# EAGLE design PowerTestbenchBoard (EAGLE 9.4.2)
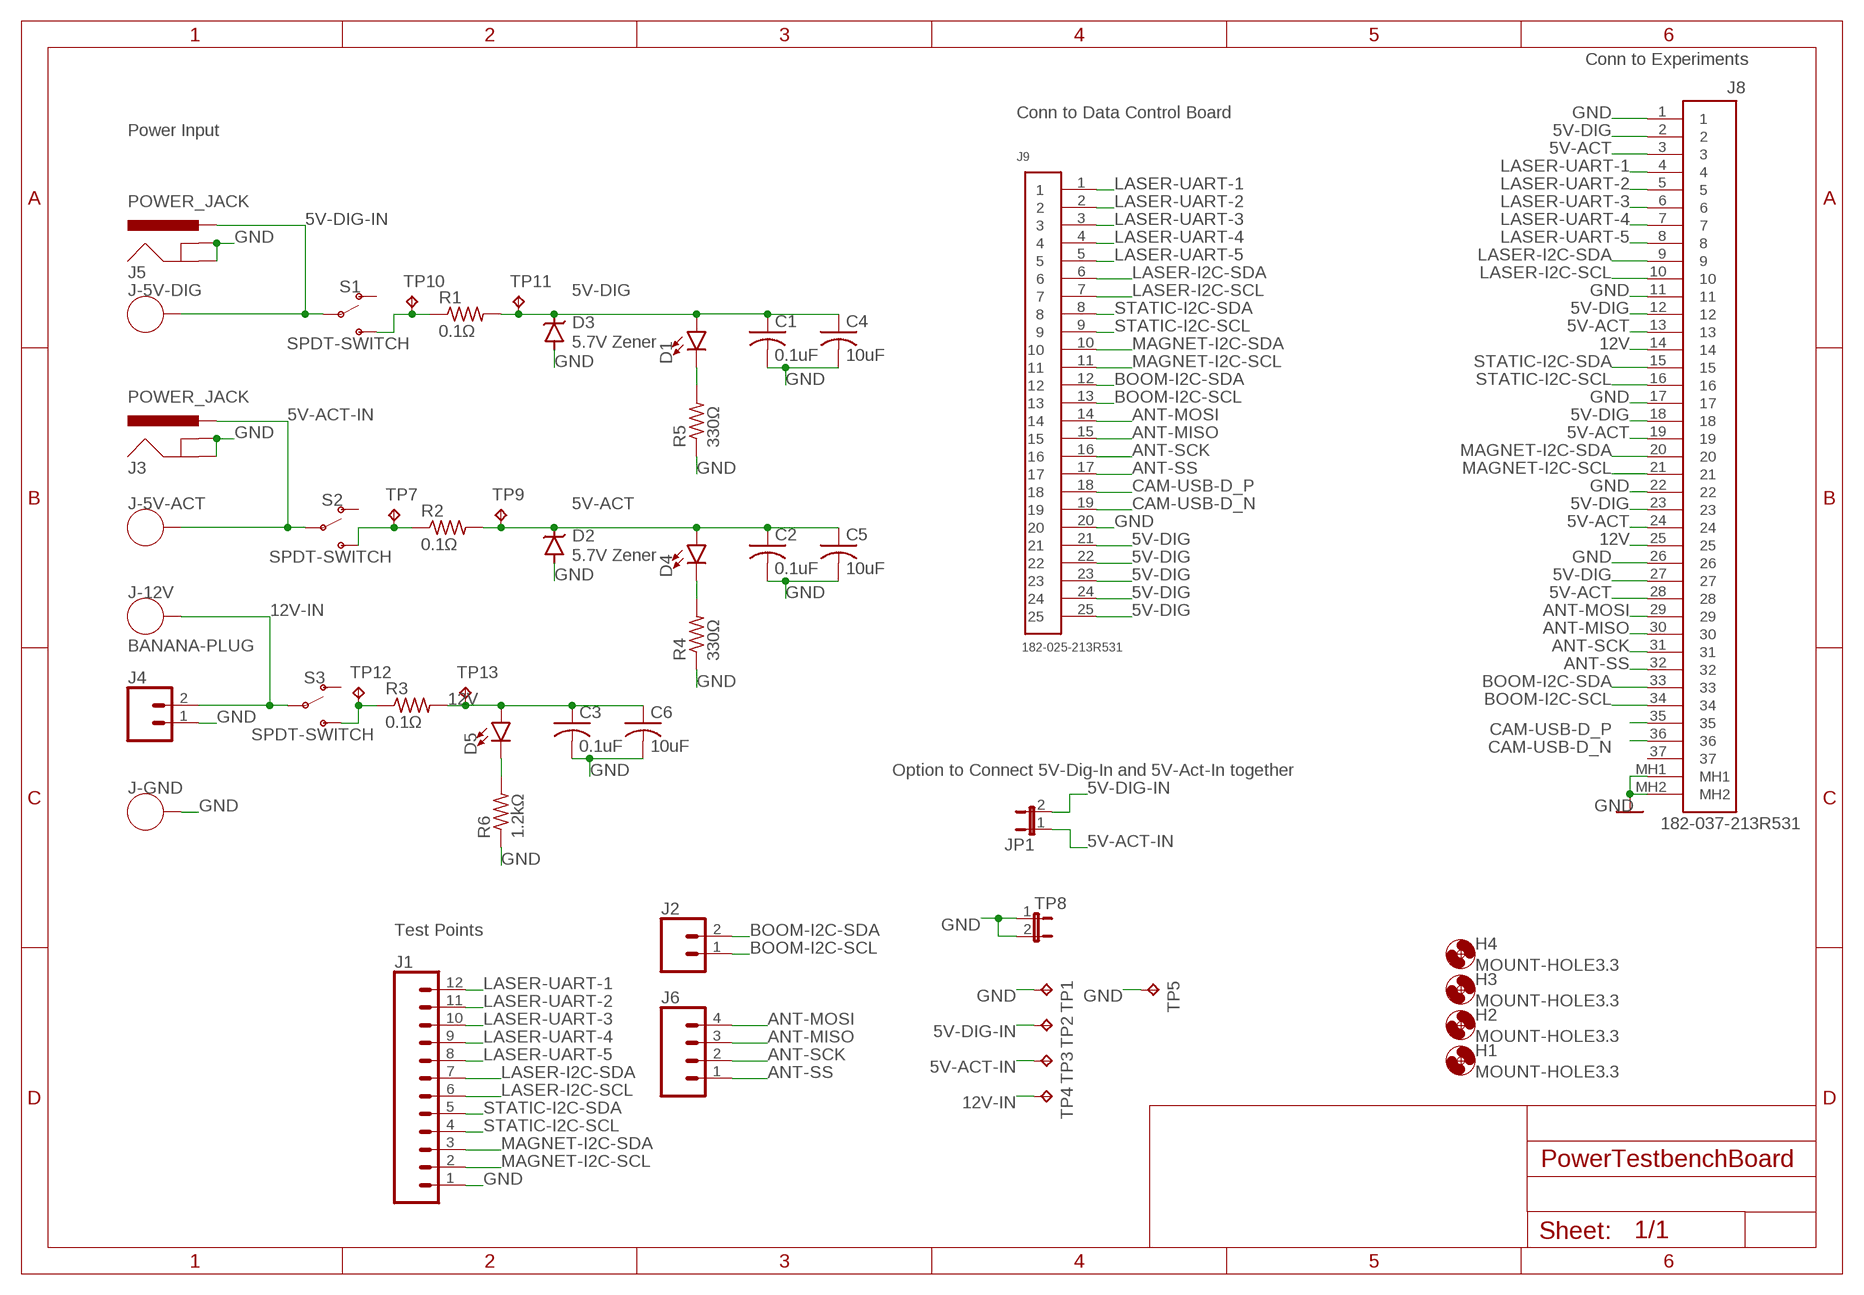
[diagram p0: schematic, sheet 1]

## Parts
C1  0.1uF  C-USC0805  [C0805]
C2  0.1uF  C-USC0805  [C0805]
C3  0.1uF  C-USC0805  [C0805]
C4  10uF  C-USC0805  [C0805]
C5  10uF  C-USC0805  [C0805]
C6  10uF  C-USC0805  [C0805]
D1  LED-3MM-NO_SILK  [LED_3MM-NS]
D2  5.7V Zener  ZENER-GENERICSMB  [SMB]
D3  5.7V Zener  ZENER-GENERICSMB  [SMB]
D4  LED-3MM-NO_SILK  [LED_3MM-NS]
D5  LED-3MM-NO_SILK  [LED_3MM-NS]
H1  MOUNT-HOLE3.3  [3,3]
H2  MOUNT-HOLE3.3  [3,3]
H3  MOUNT-HOLE3.3  [3,3]
H4  MOUNT-HOLE3.3  [3,3]
J1  CONN_12  [1X12]
J2  CONN_02  [1X02]
J3  POWER_JACK  [POWER_JACK_PTH]
J4  CONN_023.5MM  [SCREWTERMINAL-3.5MM-2]
J5  POWER_JACK  [POWER_JACK_PTH]
J6  CONN_04  [1X04]
J8  182-037-213R531  [182-037-213R531]
J9  182-025-213R531  [182-025-213R531]
J-5V-ACT  BANANA-PLUG  [BANANA-JACK]
J-5V-DIG  BANANA-PLUG  [BANANA-JACK]
J-12V  BANANA-PLUG  [BANANA-JACK]
J-GND  BANANA-PLUG  [BANANA-JACK]
JP1  JP1E  [JP1]
R1  0.1Ω  R-US_R1206  [R1206]
R2  0.1Ω  R-US_R1206  [R1206]
R3  0.1Ω  R-US_R1206  [R1206]
R4  330Ω  R-US_R0805  [R0805]
R5  330Ω  R-US_R0805  [R0805]
R6  1.2kΩ  R-US_R0805  [R0805]
S1  SPDT-SWITCH  [SWITCH_SPDT_PTH_11.6X4.0MM]
S2  SPDT-SWITCH  [SWITCH_SPDT_PTH_11.6X4.0MM]
S3  SPDT-SWITCH  [SWITCH_SPDT_PTH_11.6X4.0MM]
TP1  TPPAD1-13  [P1-13]
TP2  TPPAD1-13  [P1-13]
TP3  TPPAD1-13  [P1-13]
TP4  TPPAD1-13  [P1-13]
TP5  TPPAD1-13  [P1-13]
TP7  TPPAD1-13  [P1-13]
TP8  JP1E  [JP1]
TP9  TPPAD1-13  [P1-13]
TP10  TPPAD1-13  [P1-13]
TP11  TPPAD1-13  [P1-13]
TP12  TPPAD1-13  [P1-13]
TP13  TPPAD1-13  [P1-13]

## Nets
5V-ACT: C2.1 C5.1 D2.C D4.A J8.3 J8.13 J8.19 J8.24 J8.28 R2.2 TP9.TP
5V-ACT-IN: J3.PWR J-5V-ACT.P$1 J-5V-ACT.P$2 JP1.1 S2.2(P) TP3.TP
5V-DIG: C1.1 C4.1 D1.A D3.C J8.2 J8.12 J8.18 J8.23 J8.27 J9.21 J9.22 J9.23 J9.24 J9.25 R1.2 TP11.TP
5V-DIG-IN: J5.PWR J-5V-DIG.P$1 J-5V-DIG.P$2 JP1.2 S1.2(P) TP2.TP
12V: C3.1 C6.1 D5.A J8.14 J8.25 R3.2 TP13.TP
12V-IN: J4.2 J-12V.P$1 J-12V.P$2 S3.2(P) TP4.TP
ANT-MISO: J6.3 J8.30 J9.15
ANT-MOSI: J6.4 J8.29 J9.14
ANT-SCK: J6.2 J8.31 J9.16
ANT-SS: J6.1 J8.32 J9.17
BOOM-I2C-SCL: J2.1 J8.34 J9.13
BOOM-I2C-SDA: J2.2 J8.33 J9.12
CAM-USB-D_N [diff-pair]: J8.36 J9.19
CAM-USB-D_P [diff-pair]: J8.35 J9.18
GND: C1.2 C2.2 C3.2 C4.2 C5.2 C6.2 D2.A D3.A J1.1 J3.GND J3.GNDBREAK J4.1 J5.GND J5.GNDBREAK J8.1 J8.11 J8.17 J8.22 J8.26 J8.MH1 J8.MH2 J9.20 J-GND.P$1 J-GND.P$2 R4.1 R5.1 R6.1 TP1.TP TP5.TP TP8.1 TP8.2
LASER-I2C-SCL: J1.6 J8.10 J9.7
LASER-I2C-SDA: J1.7 J8.9 J9.6
LASER-UART-1: J1.12 J8.4 J9.1
LASER-UART-2: J1.11 J8.5 J9.2
LASER-UART-3: J1.10 J8.6 J9.3
LASER-UART-4: J1.9 J8.7 J9.4
LASER-UART-5: J1.8 J8.8 J9.5
MAGNET-I2C-SCL: J1.2 J8.21 J9.11
MAGNET-I2C-SDA: J1.3 J8.20 J9.10
N$1: R1.1 S1.1(S) TP10.TP
N$2: R2.1 S2.1(S) TP7.TP
N$3: R3.1 S3.1(S) TP12.TP
N$4: D4.K(C) R4.2
N$5: D5.K(C) R6.2
N$6: D1.K(C) R5.2
STATIC-I2C-SCL: J1.4 J8.16 J9.9
STATIC-I2C-SDA: J1.5 J8.15 J9.8
Unconnected: J8.37 S1.3(O) S2.3(O) S3.3(O)

## Notes on the sheet
- Conn to Experiments
- Conn to Data Control Board
- Power Input
- Option to Connect 5V-Dig-In and 5V-Act-In together
- Test Points

## Library data of the parts
C1-C6 = rcl:C-US: CAPACITOR, American symbol; SPICEPREFIX: C
D1 D4 D5 = SparkFun-LED:LED: LED (Generic) Standard schematic elements and footprints for 5mm, 3mm, 1206, and 0603 sized LEDs. Generic LEDs with no color specified.
D2 D3 = PowerManagementParts:ZENER-GENERIC
H1-H4 = holes:MOUNT-HOLE: MOUNTING HOLE with drill center marker
J1 = SparkFun-Connectors:CONN_12: Multi connection point. Often used as Generic Header-pin footprint for 0.1 inch spaced/style header connections On any of the 0.1 inch spaced packages, you can populate with these: Break Away Headers - Straight <https://www.sparkfun.com/products/116> (PRT-00116) Break Away Male Headers - Right Angle <https://www.sparkfun.com/products/553> (PRT-00553) Female Headers <https://www.sparkfun.com/products/115> (PRT-00115) Break Away Headers - Machine Pin <https://www.sparkfun.com/products/117> (PRT-00117) Break Away Female Headers - Swiss Machine Pin <https://www.sparkfun.com/products/743> (PRT-00743) For SCREWTERMINALS and SPRING TERMINALS visit here: Screw Terimnals on SparkFun.com <https://www.sparkfun.com/search/results?term=Screw+Terminals> (5mm/3.5mm/2.54mm spacing) This device is also useful as a general connection point to wire up your design to another part of your project. Our various solder wires solder well into these plated through hole pads. Hook-Up Wire - Assortment (Stranded, 22 AWG) <https://www.sparkfun.com/products/11375> (PRT-11375) Hook-Up Wire - Assortment (Solid Core, 22 AWG) <https://www.sparkfun.com/products/11367> (PRT-11367) View the entire wire category on our website here <https://www.sparkfun.com/categories/141> Special notes: Molex polarized connector foot print use with SKU : PRT-08231 with associated crimp pins and housings. 1MM SMD Version SKU: PRT-10208 NOTES ON THE VARIANTS LOCK and LOCK_LONGPADS... This footprint was designed to help hold the alignment of a through-hole component (i.e. 6-pin header) while soldering it into place. You may notice that each hole has been shifted either up or down by 0.005 of an inch from it's more standard position (which is a perfectly straight line). This slight alteration caused the pins (the squares in the middle) to touch the edges of the holes. Because they are alternating, it causes a "brace" to hold the component in place. 0.005 has proven to be the perfect amount of "off-center" position when using our standard breakaway headers. Although looks a little odd when you look at the bare footprint, once you have a header in there, the alteration is very hard to notice. Also,if you push a header all the way into place, it is covered up entirely on the bottom side.
J2 = SparkFun-Connectors:CONN_02: Multi connection point. Often used as Generic Header-pin footprint for 0.1 inch spaced/style header connections On any of the 0.1 inch spaced packages, you can populate with these: Break Away Headers - Straight <https://www.sparkfun.com/products/116> (PRT-00116) Break Away Male Headers - Right Angle <https://www.sparkfun.com/products/553> (PRT-00553) Female Headers <https://www.sparkfun.com/products/115> (PRT-00115) Break Away Headers - Machine Pin <https://www.sparkfun.com/products/117> (PRT-00117) Break Away Female Headers - Swiss Machine Pin <https://www.sparkfun.com/products/743> (PRT-00743) For SCREWTERMINALS and SPRING TERMINALS visit here: Screw Terimnals on SparkFun.com <https://www.sparkfun.com/search/results?term=Screw+Terminals> (5mm/3.5mm/2.54mm spacing) This device is also useful as a general connection point to wire up your design to another part of your project. Our various solder wires solder well into these plated through hole pads. Hook-Up Wire - Assortment (Stranded, 22 AWG) <https://www.sparkfun.com/products/11375> (PRT-11375) Hook-Up Wire - Assortment (Solid Core, 22 AWG) <https://www.sparkfun.com/products/11367> (PRT-11367) View the entire wire category on our website here <https://www.sparkfun.com/categories/141> Special notes: Molex polarized connector foot print use with: PRT-08233 with associated crimp pins and housings. 2.54_SCREWTERM for use with PRT-10571. 3.5mm Screw Terminal footprints for PRT-08084 5mm Screw Terminal footprints for use with PRT-08432
J3 J5 = SparkFun-Connectors:POWER_JACK: Power Jack Connector This is the standard 5.5mm barrel jack for power. The PTH is the most common, proven, reliable, footprint. The Slot footprint only works if the mill layer is transmitted to the PCB fab house so be warned. Here are the connectors we sell at SparkFun: DC Barrel Power Jack/Connector <https://www.sparkfun.com/products/119> (PRT-00119) DC Barrel Power Jack/Connector (SMD) <https://www.sparkfun.com/products/12748> (PRT-12748) DC Barrel Jack Adapter - Breadboard Compatible <https://www.sparkfun.com/products/10811> (PRT-10811) It is used on this SparkFun product (and many, many others): SparkFun RedBoard - Programmed with Arduino <https://www.sparkfun.com/products/12757> (DEV-12757) Also, if you need a mating power supply or connector, please check these out: Wall Adapter Power Supply - 9VDC 650mA <https://www.sparkfun.com/products/298> (TOL-00298) DC Barrel Jack Adapter - Male <https://www.sparkfun.com/products/10287> (PRT-10287); PROD_ID: CONN-08197
J4 = SparkFun-Connectors:CONN_02: Multi connection point. Often used as Generic Header-pin footprint for 0.1 inch spaced/style header connections On any of the 0.1 inch spaced packages, you can populate with these: Break Away Headers - Straight <https://www.sparkfun.com/products/116> (PRT-00116) Break Away Male Headers - Right Angle <https://www.sparkfun.com/products/553> (PRT-00553) Female Headers <https://www.sparkfun.com/products/115> (PRT-00115) Break Away Headers - Machine Pin <https://www.sparkfun.com/products/117> (PRT-00117) Break Away Female Headers - Swiss Machine Pin <https://www.sparkfun.com/products/743> (PRT-00743) For SCREWTERMINALS and SPRING TERMINALS visit here: Screw Terimnals on SparkFun.com <https://www.sparkfun.com/search/results?term=Screw+Terminals> (5mm/3.5mm/2.54mm spacing) This device is also useful as a general connection point to wire up your design to another part of your project. Our various solder wires solder well into these plated through hole pads. Hook-Up Wire - Assortment (Stranded, 22 AWG) <https://www.sparkfun.com/products/11375> (PRT-11375) Hook-Up Wire - Assortment (Solid Core, 22 AWG) <https://www.sparkfun.com/products/11367> (PRT-11367) View the entire wire category on our website here <https://www.sparkfun.com/categories/141> Special notes: Molex polarized connector foot print use with: PRT-08233 with associated crimp pins and housings. 2.54_SCREWTERM for use with PRT-10571. 3.5mm Screw Terminal footprints for PRT-08084 5mm Screw Terminal footprints for use with PRT-08432; PROD_ID: CONN-08399
J6 = SparkFun-Connectors:CONN_04: Multi connection point. Often used as Generic Header-pin footprint for 0.1 inch spaced/style header connections On any of the 0.1 inch spaced packages, you can populate with these: Break Away Headers - Straight <https://www.sparkfun.com/products/116> (PRT-00116) Break Away Male Headers - Right Angle <https://www.sparkfun.com/products/553> (PRT-00553) Female Headers <https://www.sparkfun.com/products/115> (PRT-00115) Break Away Headers - Machine Pin <https://www.sparkfun.com/products/117> (PRT-00117) Break Away Female Headers - Swiss Machine Pin <https://www.sparkfun.com/products/743> (PRT-00743) For SCREWTERMINALS and SPRING TERMINALS visit here: Screw Terimnals on SparkFun.com <https://www.sparkfun.com/search/results?term=Screw+Terminals> (5mm/3.5mm/2.54mm spacing) This device is also useful as a general connection point to wire up your design to another part of your project. Our various solder wires solder well into these plated through hole pads. Hook-Up Wire - Assortment (Stranded, 22 AWG) <https://www.sparkfun.com/products/11375> (PRT-11375) Hook-Up Wire - Assortment (Solid Core, 22 AWG) <https://www.sparkfun.com/products/11367> (PRT-11367) View the entire wire category on our website here <https://www.sparkfun.com/categories/141> Special notes: Molex polarized connector foot print use with SKU : PRT-08231 with associated crimp pins and housings. 1MM SMD Version SKU: PRT-10208; PROD_ID: CONN-09696
J8 = D-Sub Connectors:182-037-213R531: CONN D-SUB RCPT 37POS R/A SOLDER Manufacturer's datasheet <https://media.digikey.com/pdf/Data%20Sheets/Norcomp%20PDFs/182-YYY-213RYY1.pdf>; CREATED_BY: PCBLayout.com; DIGI_KEY_PART_NUMBER: 182-37FE-ND; MANUFACTURER: NorComp Inc.; MPN: 182-037-213R531
J9 = D-Sub Connectors:182-025-213R531: CONN D-SUB RCPT 25POS R/A SOLDER Manufacturer's datasheet <https://media.digikey.com/pdf/Data%20Sheets/Norcomp%20PDFs/182-YYY-213RYY1.pdf>; CREATED_BY: PCBLayout.com; DIGIKEY_PART_NO: 182-25FE-ND; MANUFACTURER: NorComp Inc.; MPN: 182-025-213R531
J-5V-ACT J-5V-DIG J-12V J-GND = PowerManagementParts:BANANA-PLUG
JP1 TP8 = jumper:JP1E: JUMPER
R1-R6 = rcl:R-US_: RESISTOR, American symbol; SPICEPREFIX: R
S1-S3 = PowerManagementParts:SPDT-SWITCH
TP1-TP5 TP7 TP9-TP13 = testpad:TP: Test pad

## Net classes
1 diff-pair: width 0.203 mm, drill 0.348 mm, clearance 0.203 mm

## Board
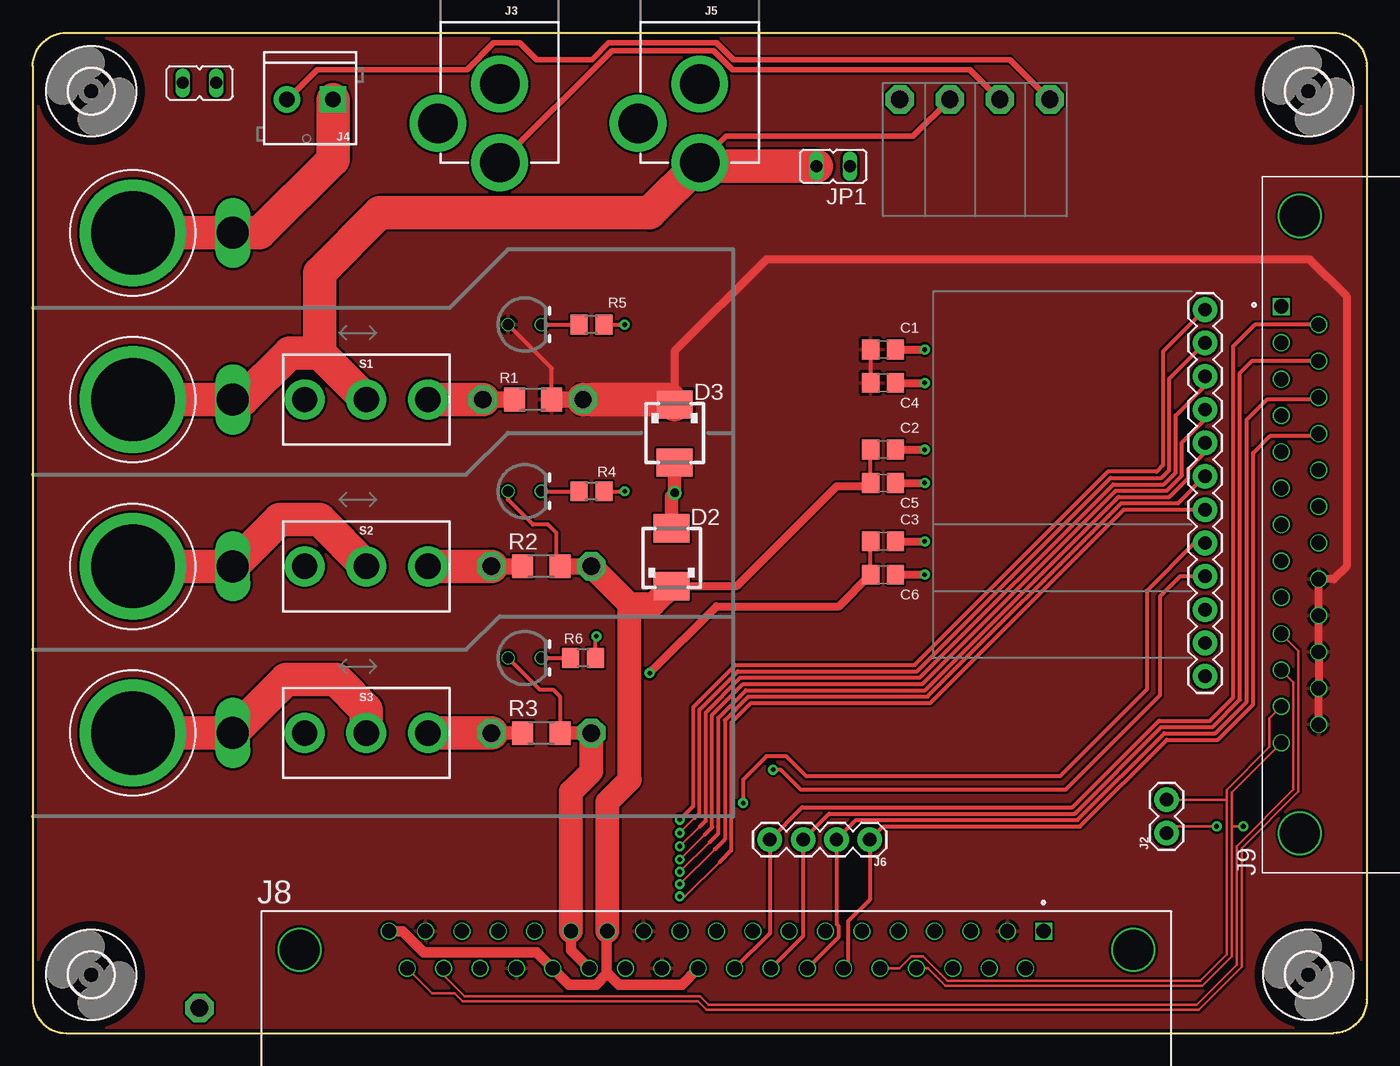
[diagram p1: board, top side]
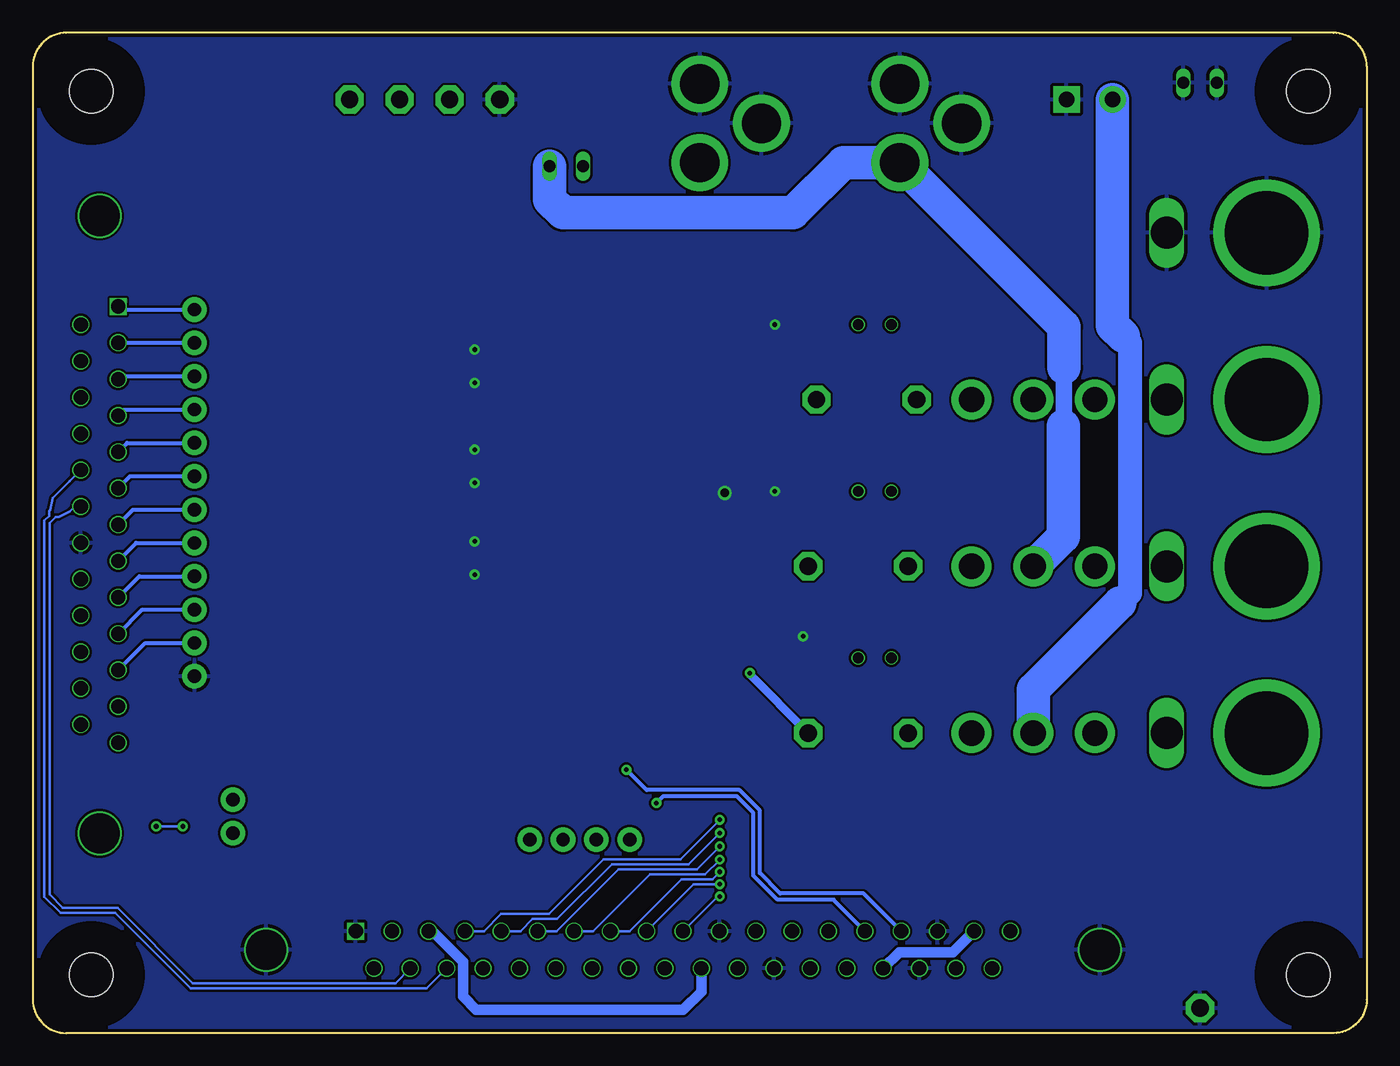
[diagram p2: board, bottom side, seen from below]

Size 101.6 x 76.2 mm. Coordinates in mm from the lower left corner, seen from the top.
Outline: 0,2.54 arc90 2.54,0 99.06,0 arc90 101.6,2.54 101.6,73.66 arc90 99.06,76.2 2.54,76.2 arc90 0,73.66 0,2.54
Copper layers (1*16): Top 0.0356mm / dielectric 1.5011mm / Bottom 0.0356mm
Design rules "PCBway": minimum track width 7mil, minimum drill 10mil, track to track 7mil, track to pad 7mil, pad to pad 7mil, via to via 7mil, smd to smd 0mil, copper to edge 10mil, drill to drill 10mil, minimum pad ring 4mil, minimum via ring 8mil, stop-mask expansion 4mil, vias tented up to drill 0mil, thermal gap 10mil

### Footprints (pad centres in the part's own frame; a part is rotated, then mirrored left to right if it is on the bottom)
C0805 = smd 1.3 x 1.5: 1 -0.95,0; 2 0.95,0
LED_3MM-NS = drill 0.813: A -1.27,0; K 1.27,0
SMB = smd 2.159 x 2.743: A 2.261,0; C -2.159,0
3,3 = hole 3.3: 0,0
1X12 = drill 1.016 pad 1.88: 1 0,0; 2 2.54,0; 3 5.08,0; 4 7.62,0; 5 10.16,0; 6 12.7,0; 7 15.24,0; 8 17.78,0; 9 20.32,0; 10 22.86,0; 11 25.4,0; 12 27.94,0
1X02 = drill 1.016 pad 1.88: 1 0,0; 2 2.54,0
POWER_JACK_PTH = drill 2.997 pad 4.318: GND 0,7.7; GNDBREAK 4.7,10.7; PWR 0,13.7
SCREWTERMINAL-3.5MM-2 = drill 1.2 pad 2.032 square: 1 0,0 | drill 1.2 pad 2.032: 2 3.5,0
1X04 = drill 1.016 pad 1.88: 1 0,0; 2 2.54,0; 3 5.08,0; 4 7.62,0
182-037-213R531 = drill 1.09 square: 1 24.93,1.42 | drill 1.09: 2 22.16,1.42; 3 19.39,1.42; 4 16.62,1.42; 5 13.85,1.42; 6 11.08,1.42; 7 8.31,1.42; 8 5.54,1.42; 9 2.77,1.42; 10 0,1.42; 11 -2.77,1.42; 12 -5.54,1.42; 13 -8.31,1.42; 14 -11.08,1.42; 15 -13.85,1.42; 16 -16.62,1.42; 17 -19.39,1.42; 18 -22.16,1.42; 19 -24.93,1.42; 20 -23.545,-1.42; 21 -20.775,-1.42; 22 -18.005,-1.42; 23 -15.235,-1.42; 24 -12.465,-1.42; 25 -9.695,-1.42; 26 -6.925,-1.42; 27 -4.155,-1.42; 28 -1.385,-1.42; 29 1.385,-1.42; 30 4.155,-1.42; 31 6.925,-1.42; 32 9.695,-1.42; 33 12.465,-1.42; 34 15.235,-1.42; 35 18.005,-1.42; 36 20.775,-1.42; 37 23.545,-1.42 | drill 3.05: MH1 -31.75,0; MH2 31.75,0
182-025-213R531 = drill 1.09 square: 1 16.62,1.42 | drill 1.09: 2 13.85,1.42; 3 11.08,1.42; 4 8.31,1.42; 5 5.54,1.42; 6 2.77,1.42; 7 0,1.42; 8 -2.77,1.42; 9 -5.54,1.42; 10 -8.31,1.42; 11 -11.08,1.42; 12 -13.85,1.42; 13 -16.62,1.42; 14 15.235,-1.42; 15 12.465,-1.42; 16 9.695,-1.42; 17 6.925,-1.42; 18 4.155,-1.42; 19 1.385,-1.42; 20 -1.385,-1.42; 21 -4.155,-1.42; 22 -6.925,-1.42; 23 -9.695,-1.42; 24 -12.465,-1.42; 25 -15.235,-1.42 | drill 3.05: MH1 -23.52,0; MH2 23.52,0
BANANA-JACK = drill 6.35 pad 8.128: P$1 0,0 | drill 2.438 long: P$2 0,-7.62
JP1 = drill 0.914 long: 1 0,-1.27; 2 0,1.27
R1206 = smd 1.6 x 1.803: 1 -1.422,0; 2 1.422,0
R0805 = smd 1.3 x 1.5: 1 -0.95,0; 2 0.95,0
SWITCH_SPDT_PTH_11.6X4.0MM = drill 1.93 pad 3.048: 1 0,4.699; 2 0,0; 3 0,-4.699
P1-13 = drill 1.321 pad 2.159 octagon: TP 0,0

### Placement (x,y rotation side)
C1  64.77,52.07 0 top
C2  64.77,44.45 0 top
C3  64.77,37.47 0 top
C4  64.77,49.53 0 top
C5  64.77,41.91 0 top
C6  64.77,34.92 0 top
D1  37.47,53.98 0 top
D2  48.64,36.2 90 top
D3  48.9,45.72 270 top
D4  37.47,41.27 0 top
D5  37.47,28.57 0 top
H1  97.16,4.45 90 top
H2  97.16,71.75 90 top
H3  4.45,71.75 90 top
H4  4.45,4.45 90 top
J1  89.28,27.18 90 top
J2  86.36,15.24 90 top
J3  35.56,80.01 180 top
J4  22.86,71.12 180 top
J5  50.8,80.01 180 top
J6  63.75,14.73 180 top
J8  52.07,6.35 0 top
J9  96.52,38.73 90 top
J-5V-ACT  7.62,35.56 90 top
J-5V-DIG  7.62,48.26 90 top
J-12V  7.62,22.86 90 top
J-GND  7.62,60.96 90 top
JP1  60.96,66.04 90 top
R1  38.1,48.26 0 top
R2  38.73,35.56 0 top
R3  38.73,22.86 0 top
R4  42.55,41.27 180 top
R5  42.55,53.98 180 top
R6  41.91,28.57 180 top
S1  25.4,48.26 270 top
S2  25.4,35.56 270 top
S3  25.4,22.86 270 top
TP1  66.04,71.12 90 top
TP2  69.85,71.12 90 top
TP3  73.66,71.12 90 top
TP4  77.47,71.12 90 top
TP5  12.7,1.91 0 top
TP7  34.92,35.56 0 top
TP8  12.7,72.39 90 top
TP9  42.55,35.56 0 top
TP10  34.29,48.26 0 top
TP11  41.91,48.26 0 top
TP12  34.92,22.86 0 top
TP13  42.55,22.86 0 top

### Tracks (layer width: path | path; a pad name or v marks a point on that pad's centre or on a via)
5V-ACT
  Top 0.305: D4.A 36.2,40.64 38.1,38.73 39.24,38.73 39.88,38.1 39.88,35.84 R2.2 | C5.1 C2.1
  Top 0.61: C5.1 63.57,41.66 61.21,41.66 53.59,34.04 D2.C
  Top 0.813: J8.19 28.17,7.77 29.78,6.16 38.37,6.16 J8.24 40.84,3.7 42.88,3.7 43.69,4.5 | J8.13 43.69,7.7 43.69,4.5 | 43.69,4.5 43.83,4.5 44.63,3.7 49.45,3.7 J8.28
  Top 1.27: TP9.TP R2.2
  Top 1.829: J8.13 43.76,17.6 45.47,19.3 45.47,32.64 | TP9.TP 45.47,32.64 | D2.C 47.24,32.64 45.47,32.64
  Bottom 0.813: J8.3 71.14,7.77 68.82,5.45 68.82,4.41 68.83,4.39 68.83,2.79 67.82,1.78 52.07,1.78 50.69,3.16 J8.28
5V-ACT-IN
  Top 0.406: J3.PWR 44.1,74.85 51.85,74.85 53.3,73.41 71.37,73.41 TP3.TP
  Top 2.54: J-5V-ACT.P$1 J-5V-ACT.P$2 18.8,39.12 21.84,39.12 S2.2
  Bottom 1.27: 23.11,46.23 23.11,47.24 23.06,47.29 23.06,50.7
  Bottom 2.54: S2.2 23.11,37.85 23.11,46.23 | 23.06,50.7 23.06,53.81 J3.PWR 39.86,66.31 43.69,62.48 61.21,62.48 62.23,63.5 JP1.1
5V-DIG
  Top 0.305: R1.2 39.52,50.65 D1.A | C1.1 C4.1
  Top 0.61: J9.25 J9.24 J9.23 J9.22 J9.21 99.1,34.58 100.08,35.56 100.08,56.13 97.28,58.93 55.88,58.93 48.9,51.94 D3.C
  Top 1.27: R1.2 TP11.TP
  Top 2.54: TP11.TP 48.51,48.26 D3.C
  Bottom 0.813: J8.23 35.6,6.16 31.52,6.16 J8.18
  pour Top: 2.54,0 arc-90 0,2.54 0,73.66 arc-90 2.54,76.2 99.06,76.2 arc-90 101.6,73.66 101.6,2.54 arc-90 99.06,0
5V-DIG-IN
  Top 0.406: J5.PWR 50.92,66.43 52.82,68.33 67.06,68.33 TP2.TP
  Top 2.54: J-5V-DIG.P$1 J-5V-DIG.P$2 16,48.26 19.56,51.82 21.84,51.82 | 21.84,51.82 S1.2 | J5.PWR 46.97,62.48 26.42,62.48 21.84,57.91 21.84,51.82 | JP1.2 51.31,66.04 50.92,66.43
12V  (via drill 0.35)
  Top 0.305: D5.A 38.61,26.16 39.62,26.16 40.16,25.63 R3.2 | C6.1 C3.1
  Top 0.61: v46.99,27.43 52.07,32.51 61.41,32.51 C6.1
  Top 0.813: J8.14 40.99,6.32 J8.25
  Top 1.016: R3.2 TP13.TP
  Top 1.829: J8.14 40.99,18.38 42.55,19.94 TP13.TP
  Bottom 0.61: TP13.TP 46.99,27.3 v46.99,27.43
12V-IN
  Top 0.406: J4.2 21.65,73.41 33.06,73.41 35.09,75.43 37.09,75.43 38.35,74.17 42.59,74.17 43.86,75.43 52.09,75.43 53.36,74.17 74.42,74.17 TP4.TP
  Top 2.54: J-12V.P$1 J-12V.P$2 19.3,26.92 23.11,26.92 25.4,24.64 S3.2
  Bottom 1.829: 18.54,53.09 18.03,52.58 18.03,33.53 18.8,32.77
  Bottom 2.54: J4.2 19.36,53.9 18.54,53.09 | 18.8,32.77 25.4,26.16 S3.2
ANT-MISO
  Top 0.305: J9.15 92.86,51.2 91.95,50.29 91.95,25.4 89.86,23.32 85.98,23.32 79.37,16.71 60.66,16.71 J6.3 58.67,7.38 J8.30
ANT-MOSI
  Top 0.305: J9.14 93.09,53.97 91.44,52.32 91.44,25.58 89.66,23.8 85.78,23.8 79.17,17.2 58.6,17.2 J6.4 56.13,7.61 J8.29
ANT-SCK
  Top 0.305: J9.16 97.77,48.26 93.98,48.26 92.46,46.74 92.46,25.23 90.06,22.84 86.18,22.84 79.57,16.23 62.71,16.23 J6.2 61.21,8.32 61.36,8.18 61.36,7.29 J8.31
ANT-SS
  Top 0.305: J9.17 97.75,45.47 94.23,45.47 92.96,44.2 92.96,25.05 90.26,22.35 86.38,22.35 79.77,15.75 64.77,15.75 J6.1 63.75,10.16 62.1,8.51 62.1,5.27 J8.32
BOOM-I2C-SCL  (via drill 0.35)
  Top 0.203: J9.13 91.31,18.33 91.31,15.75 | 91.31,15.75 91.31,5.84 89.07,3.6 69.52,3.6 68.74,4.38 68.19,4.93 J8.34 | 91.31,15.75 v92.2,15.75 | J2.1 86.87,15.75 v90.17,15.75
  Bottom 0.203: v92.2,15.75 v90.17,15.75
BOOM-I2C-SDA
  Top 0.203: J9.12 94.17,23.96 94.17,21.78 90.93,18.54 90.93,17.78 | 90.93,17.78 90.93,6 88.91,3.98 69.68,3.98 69.12,4.54 | 69.12,4.54 | J8.33 66,4.93 66.92,5.86 67.8,5.86 69.12,4.54 | 90.93,17.78 J2.2
CAM-USB-D_N
  Bottom 0.203: J8.36 73.97,3.81 89.41,3.81 95.15,9.55 99.31,9.55 100.33,10.57 100.33,38.86 99.86,39.33 99.62,39.33 98.79,39.72 98.39,40.12 J9.19
CAM-USB-D_P
  Bottom 0.203: J8.35 71.6,3.4 89.58,3.4 95.32,9.14 99.48,9.14 100.74,10.4 100.74,39.03 100.36,39.4 100.36,39.76 100.27,39.86 100.08,40.76 98.79,42.04 J9.18
GND  (via drill 0.35, 0.65)
  Top 0.305: R5.1 v45.09,53.98 | R4.1 v45.09,41.27 | R6.1 42.86,30.16 v42.93,30.23
  Top 0.61: C6.2 v67.94,34.92 | C3.2 v67.94,37.47 | C5.2 v67.94,41.91 | C2.2 v67.94,44.45 | C4.2 v67.94,49.53 | C1.2 v67.94,52.07
  Top 1.016: D3.A v48.9,41.15 48.64,40.89 D2.A
  Top 2.54: J-GND.P$1 J-GND.P$2 17.27,60.96 22.86,66.55 J4.1
  pour Bottom: 2.54,0 arc-90 0,2.54 0,73.66 arc-90 2.54,76.2 99.06,76.2 arc-90 101.6,73.66 101.6,2.54 arc-90 99.06,0
LASER-I2C-SCL  (via drill 0.35)
  Top 0.203: v49.28,10.41 49.7,10.41 52.32,13.04
  Top 0.305: 52.32,13.04 53.19,13.91 53.19,23.62 54.71,25.15 68.36,25.15 83.09,39.88 J1.6
  Bottom 0.203: J8.10 49.43,10.41 v49.28,10.41
  Bottom 0.305: J9.7 93.96,39.88 J1.6
LASER-I2C-SDA  (via drill 0.35)
  Top 0.203: v49.28,11.35 51.94,14.02
  Top 0.305: 51.94,14.02 52.7,14.78 52.7,23.82 54.51,25.63 68.16,25.63 82.89,40.36 87.22,40.36 J1.7
  Bottom 0.203: J8.9 51.26,11.35 v49.28,11.35
  Bottom 0.305: J9.6 94.19,42.42 J1.7
LASER-UART-1  (via drill 0.35)
  Top 0.305: J1.12 86.08,51.92 86.08,43.26 85.6,42.77 81.89,42.77 67.16,28.04 53.51,28.04 50.29,24.82 50.29,17.27 v49.28,16.26
  Bottom 0.203: J8.4 67.23,7.77 65.92,9.08 62.3,9.08 58.12,13.25 52.28,13.25 v49.28,16.26
  Bottom 0.305: J9.1 94.86,55.12 J1.12
LASER-UART-2  (via drill 0.35)
  Top 0.203: v49.28,15.24 50.42,16.38
  Top 0.305: 50.42,16.38 50.77,16.74 50.77,24.62 53.71,27.56 67.36,27.56 82.09,42.29 85.96,42.29 86.56,42.89 86.56,49.86 J1.11
  Bottom 0.203: J8.5 64.46,7.77 63.53,8.7 61.66,8.7 57.49,12.87 51.64,12.87 v49.28,15.24
  Bottom 0.305: J9.2 J1.11
LASER-UART-3  (via drill 0.35)
  Top 0.203: v49.28,14.22 50.8,15.75
  Top 0.305: 50.8,15.75 51.26,16.2 51.26,24.42 53.91,27.08 67.56,27.08 82.29,41.81 86.16,41.81 87.05,42.69 87.05,47.06 89.28,49.29 J1.10
  Bottom 0.203: v49.28,14.22 51.01,12.49 56.97,12.49 61.69,7.77 J8.6
  Bottom 0.305: J9.3 94.88,50.04 J1.10
LASER-UART-4  (via drill 0.35)
  Top 0.203: v49.28,13.22 51.18,15.12
  Top 0.305: 51.18,15.12 51.74,15.68 51.74,24.22 54.11,26.59 67.76,26.59 82.49,41.33 86.36,41.33 87.53,42.49 87.53,45 89.28,46.75 J1.9
  Bottom 0.203: v49.28,13.22 50.38,12.11 54.58,12.11 58.92,7.77 J8.7
  Bottom 0.305: J9.4 94.65,47.5 J1.9
LASER-UART-5  (via drill 0.35)
  Top 0.203: v49.28,12.28 51.56,14.57
  Top 0.305: 51.56,14.57 52.22,15.23 52.22,24.02 54.31,26.11 67.96,26.11 82.69,40.84 86.56,40.84 88.01,42.29 88.01,42.94 89.28,44.21 J1.8
  Bottom 0.203: v49.28,12.28 49.83,11.73 52.19,11.73 56.15,7.77 J8.8
  Bottom 0.305: J9.5 94.42,44.96 J1.8
MAGNET-I2C-SCL
  Top 0.203: J8.21 31.3,4.39 32.89,2.79 50.83,2.79 51.47,2.16 88.65,2.16 91.69,5.21 91.69,14.22 96.03,18.56 96.03,26.73 J9.11
  Bottom 0.305: J9.11 93.04,29.72 J1.2
MAGNET-I2C-SDA
  Top 0.203: J8.20 30.42,3.03 32.12,3.03 32.73,2.41 50.67,2.41 51.31,1.78 88.8,1.78 92.08,5.05 92.08,14.07 96.41,18.4 96.41,29.12 J9.10
  Bottom 0.305: J9.10 93.27,32.26 J1.3
N$1
  Top 1.27: TP10.TP R1.1
  Top 2.54: S1.1 TP10.TP
N$2
  Top 1.27: TP7.TP R2.1
  Top 2.54: S2.1 TP7.TP
N$3
  Top 1.016: R3.1 TP12.TP
  Top 2.54: S3.1 TP12.TP
N$4
  Top 0.305: D4.K R4.2
N$5
  Top 0.305: D5.K R6.2
N$6
  Top 0.305: D1.K R5.2
STATIC-I2C-SCL  (via drill 0.35)
  Top 0.305: J1.4 87.38,34.8 85.85,33.27 85.85,25.74 78.65,18.54 58.51,18.54 56.98,20.07 v56.39,20.07
  Bottom 0.305: J9.9 93.5,34.8 J1.4 | J8.16 38.32,10.64 44.68,10.64 46.23,12.19 46.23,16.96 47.78,18.52 54.84,18.52 v56.39,20.07
STATIC-I2C-SDA  (via drill 0.35)
  Top 0.305: J1.5 88.48,37.34 84.84,33.7 84.84,26.16 78.23,19.56 58.93,19.56 57.4,21.08 55.88,21.08 54.1,19.3 v54.1,17.53
  Bottom 0.305: J9.8 93.73,37.34 J1.5 | J8.15 40.61,10.16 44.88,10.16 46.71,11.99 46.71,16.76 47.98,18.03 53.59,18.03 v54.1,17.53

### Text on the board
tDocu: Jumper On- / Connect 5V-Dig / & 5V-Act inputs | GND | GND | 5V-DIG | 5V-ACT | 12V | 12V | GND | 5V-ACT | 5V-DIG | GND | ON OFF | 5V-DIG | Laser | ON OFF | UART1 / UART2 / UART3 / UART4 / UART5 / SDA / SCL / SDA / SCL / SDA / SCL / GND | 5V-ACT | Static | Power Testbench Board / Mines RockSat-X 2019 / Mark Gilliland, Graham Braly | Rev 1.0 | Magnet | ON OFF | 12V | ANT-MOSI / ANT-MISO / ANT-SCK / ANT-SS | Boom-SDA / Boom-SCL | GND